# EAGLE design 1P3W_v1p0 (EAGLE 9.6.2)
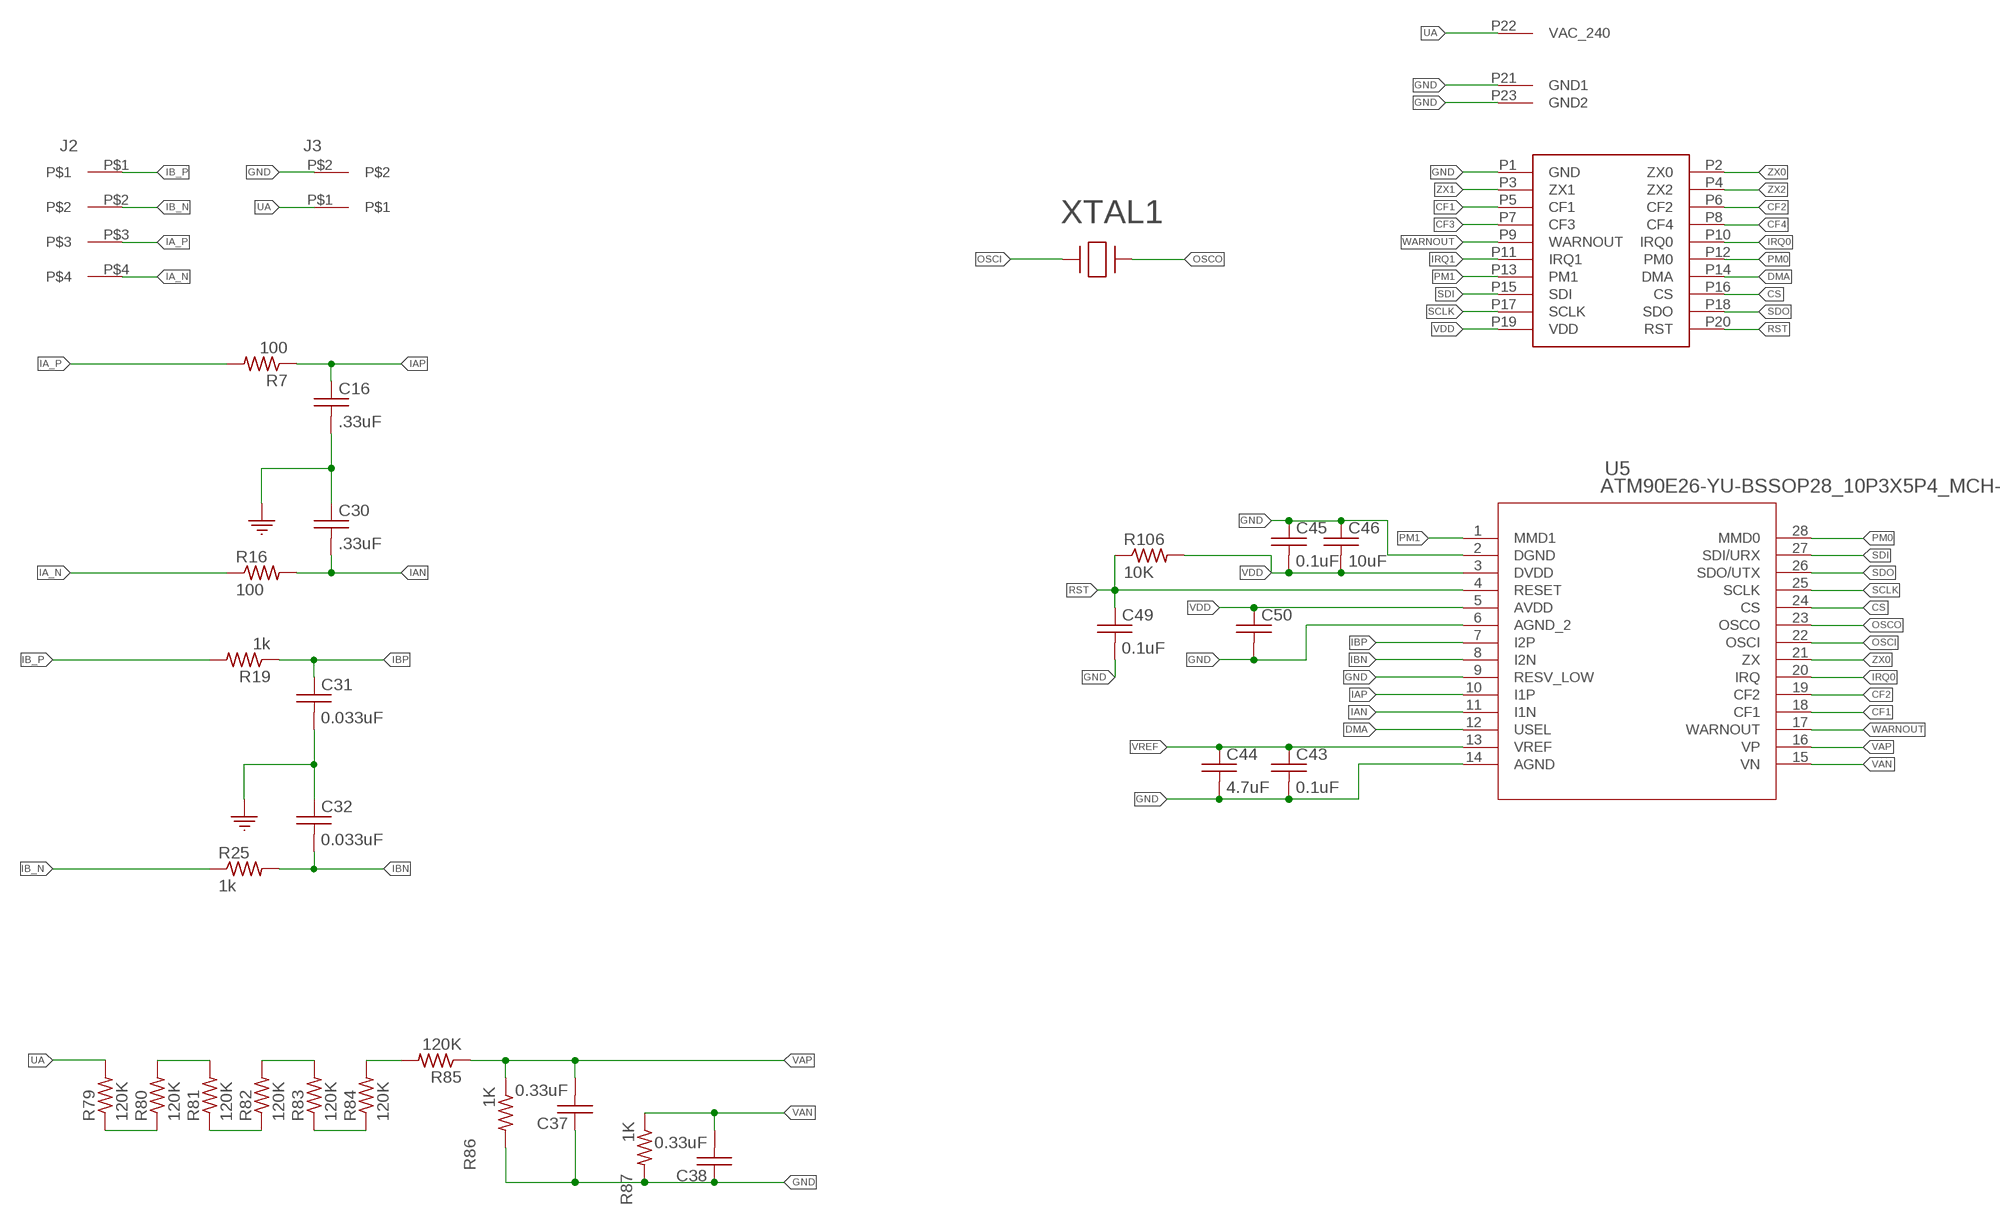
[diagram p0: schematic, sheet 1]

## Parts
C16  .33uF  C_0402  [0402]
C30  .33uF  C_0402  [0402]
C31  0.033uF  C_0402  [0402]
C32  0.033uF  C_0402  [0402]
C37  0.33uF  C_0402  [0402]
C38  0.33uF  C_0402  [0402]
C43  0.1uF  C_0402  [0402]
C44  4.7uF  C_0402  [0402]
C45  0.1uF  C_0402  [0402]
C46  10uF  C_0402  [0402]
C49  0.1uF  C_0402  [0402]
C50  C_0402  [0402]
J2  3.81MM_1_X_4_RT_ANGLE_PLUG_HEADER  [1X4_3.81MM_PITCH]
J3  3.81MM_1_X_2_RT_ANGLE_PLUG_HEADER  [2_3.81MM_PITCH]
R7  100  R_0402  [0402]
R16  100  R_0402  [0402]
R19  1k  R_0402  [0402]
R25  1k  R_0402  [0402]
R79  120K  R_0402  [0402]
R80  120K  R_0402  [0402]
R81  120K  R_0402  [0402]
R82  120K  R_0402  [0402]
R83  120K  R_0402  [0402]
R84  120K  R_0402  [0402]
R85  120K  R_0402  [0402]
R86  1K  R_0402  [0402]
R87  1K  R_0402  [0402]
R106  10K  R_0402  [0402]
U5  ATM90E26-YU-BSSOP28_10P3X5P4_MCH-M  [SSOP28_10P3X5P4_MCH-M]
U$1  METER_BASE  [METER_BASE]
XTAL1  ABLS-8.192MHZ-B2-TXTAL_HC/49US_ABLS_ABR-M  [XTAL_HC/49US_ABLS_ABR-M]

## Nets
CF1: U5.18(CF1) U$1.P5(CF1)
CF2: U5.19(CF2) U$1.P6(CF2)
CF3: U$1.P7(CF3)
CF4: U$1.P8(CF4)
CS: U5.24(CS) U$1.P16(CS)
DMA: U5.12(USEL) U$1.P14(DMA)
GND: C16.P$2 C30.P$1 C31.P$2 C32.P$1 C37.P$1 C38.P$1 C43.P$2 C44.P$2 C45.P$1 C46.P$1 C49.P$2 C50.P$2 J3.P$2 R86.P$2 R87.P$2 U5.2(DGND) U5.6(AGND_2) U5.9(RESV_LOW) U5.14(AGND) U$1.P1(GND) U$1.P21(GND1) U$1.P23(GND2)
IA_N: J2.P$4 R16.P$1
IA_P: J2.P$3 R7.P$2
IAN: C30.P$2 R16.P$2 U5.11(I1N)
IAP: C16.P$1 R7.P$1 U5.10(I1P)
IB_N: J2.P$2 R25.P$1
IB_P: J2.P$1 R19.P$2
IBN: C32.P$2 R25.P$2 U5.8(I2N)
IBP: C31.P$1 R19.P$1 U5.7(I2P)
IRQ0: U5.20(IRQ) U$1.P10(IRQ0)
IRQ1: U$1.P11(IRQ1)
N$37: R79.P$1 R80.P$1
N$38: R80.P$2 R81.P$2
N$39: R81.P$1 R82.P$1
N$40: R82.P$2 R83.P$2
N$41: R83.P$1 R84.P$1
N$42: R84.P$2 R85.P$2
OSCI: U5.22(OSCI) XTAL1.1
OSCO: U5.23(OSCO) XTAL1.2
PM0: U5.28(MMD0) U$1.P12(PM0)
PM1: U5.1(MMD1) U$1.P13(PM1)
RST: C49.P$1 R106.P$1 U5.4(RESET) U$1.P20(RST)
SCLK: U5.25(SCLK) U$1.P17(SCLK)
SDI: U5.27(SDI/URX) U$1.P15(SDI)
SDO: U5.26(SDO/UTX) U$1.P18(SDO)
UA: J3.P$1 R79.P$2 U$1.P22(VAC_240)
VAN: C38.P$2 R87.P$1 U5.15(VN)
VAP: C37.P$2 R85.P$1 R86.P$1 U5.16(VP)
VDD: C45.P$2 C46.P$2 C50.P$1 R106.P$2 U5.3(DVDD) U5.5(AVDD) U$1.P19(VDD)
VREF: C43.P$1 C44.P$1 U5.13(VREF)
WARNOUT: U5.17(WARNOUT) U$1.P9(WARNOUT)
ZX0: U5.21(ZX) U$1.P2(ZX0)
ZX1: U$1.P3(ZX1)
ZX2: U$1.P4(ZX2)

## Library data of the parts
C16 C30-C32 C37 C38 C43-C46 C49 C50 = 3D_MIG_Controller:C_0402
J2 = 3D_MIG_Controller:3.81MM_1_X_4_RT_ANGLE_PLUG_HEADER
J3 = 3D_MIG_Controller:3.81MM_1_X_2_RT_ANGLE_PLUG_HEADER
R7 R16 R19 R25 R79-R87 R106 = 3D_MIG_Controller:R_0402
U5 = 3D_MIG_Controller:ATM90E26-YU-B; BUILT_BY: EMA_Molly; COPYRIGHT: Copyright (C) 2018 Accelerated Designs. All rights reserved; MANUFACTURER_PART_NUMBER: ATM90E26-YU-B; SOURCELIBRARY: Microchip_2019-08-23_24; VENDOR: Microchip
U$1 = 3D_MIG_Controller:METER_BASE
XTAL1 = 3D_MIG_Controller:ABLS-8.192MHZ-B2-T; BUILT_BY: EMA_Cory; COPYRIGHT: Copyright (C) 2018 Accelerated Designs. All rights reserved; DATASHEET: https://abracon.com/Resonators/abls.pdf; MANUFACTURER_PART_NUMBER: ABLS-8.192MHZ-B2-T; SOURCELIBRARY: Abracon_2020-04-08; VENDOR: Abracon

## Board
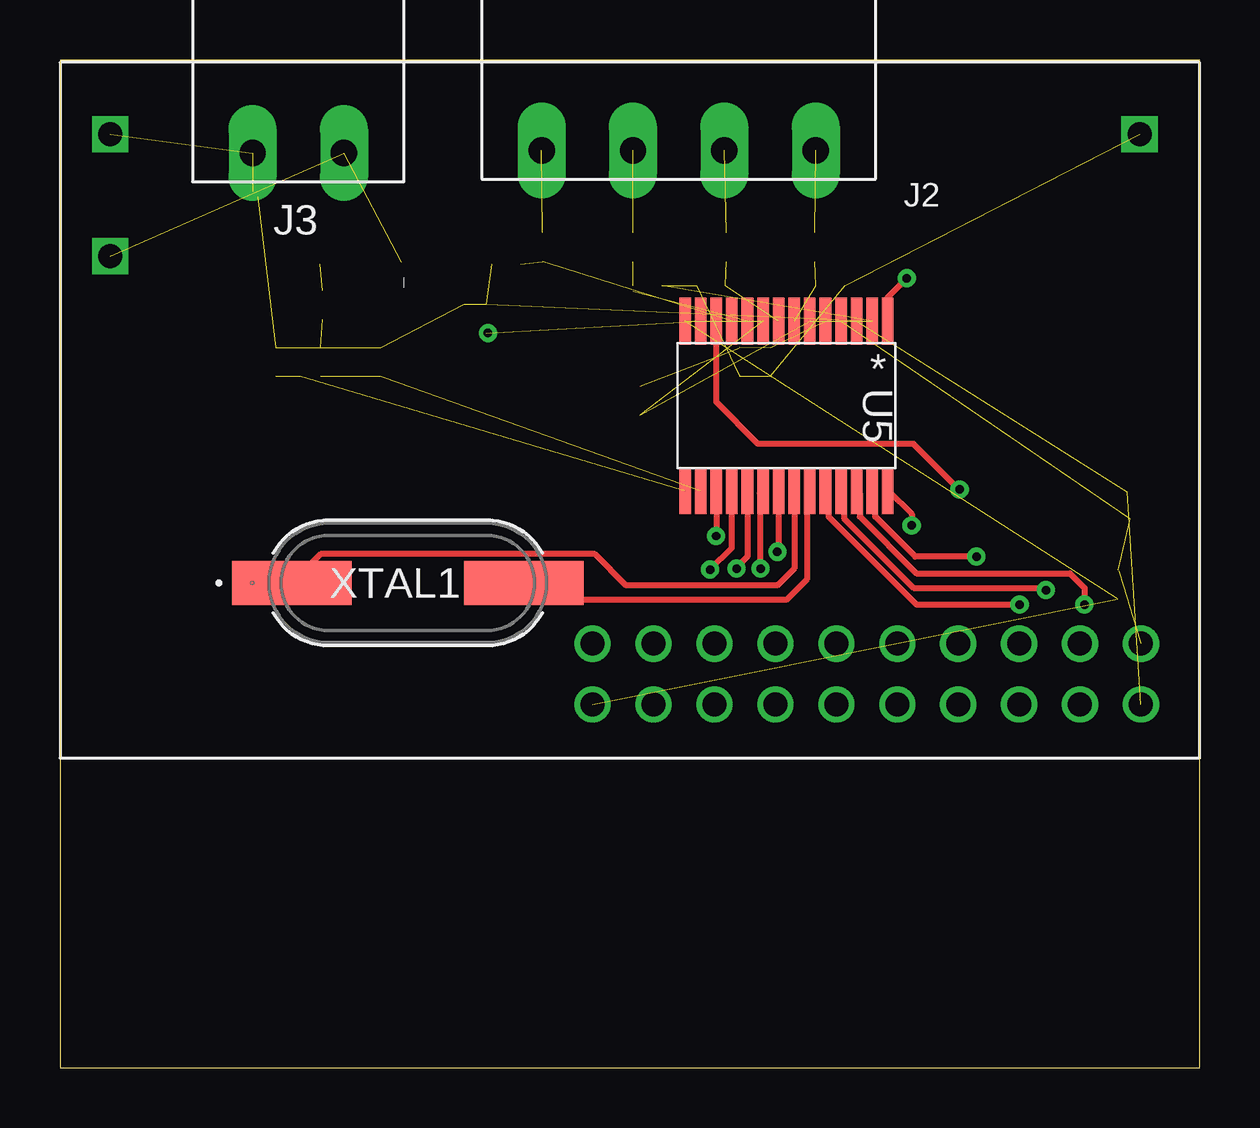
[diagram p1: board, top side]
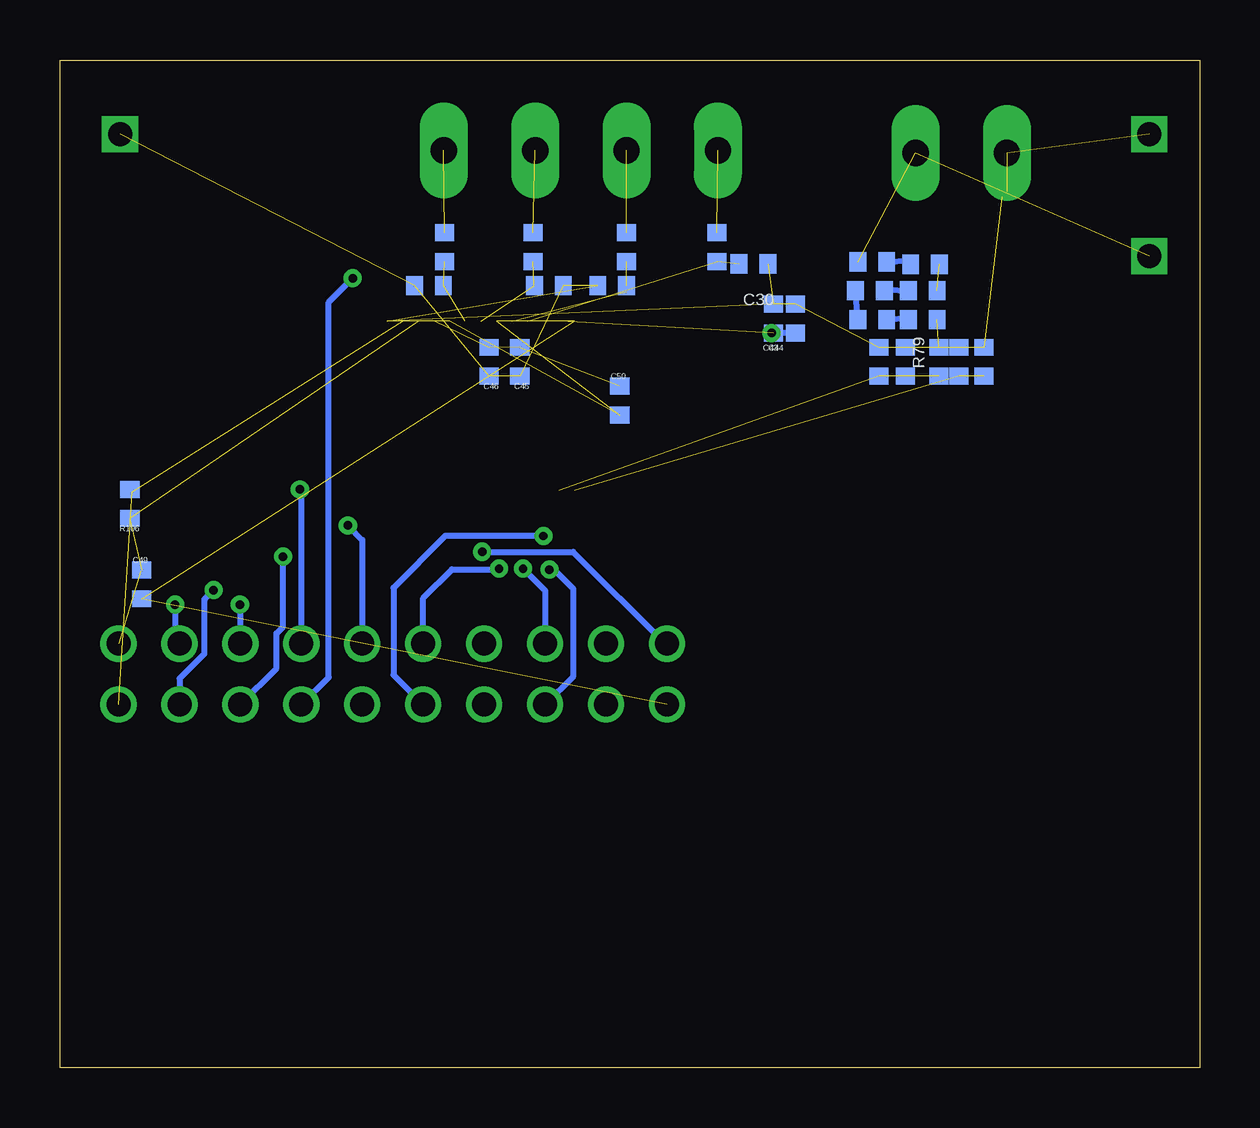
[diagram p2: board, bottom side, seen from below]

Size 47.5 x 42 mm. Coordinates in mm from the lower left corner, seen from the top.
Outline: 0,0 47.5,0 47.5,42 0,42 0,0
Copper layers (1*16): Top 0.035mm / dielectric 1.5mm / Bottom 0.035mm
Design rules "default": minimum track width 6mil, minimum drill 0.35mm, track to track 6mil, track to pad 6mil, pad to pad 6mil, via to via 6mil, smd to smd 6mil, copper to edge 40mil, drill to drill 6mil, minimum pad ring 10mil, minimum via ring 8mil, stop-mask expansion 4mil, vias tented up to drill 0mil, thermal gap 10mil

### Footprints (pad centres in the part's own frame; a part is rotated, then mirrored left to right if it is on the bottom)
0402 = smd 0.8 x 0.7: P$1 0,0.6; P$2 0,-0.6
1X4_3.81MM_PITCH = drill 1.1 pad 2 long: P$1 0,0; P$2 3.81,0; P$3 7.62,0; P$4 11.43,0
2_3.81MM_PITCH = drill 1.1 pad 2 long: P$1 0,0; P$2 3.81,0
SSOP28_10P3X5P4_MCH-M = smd 1.956 x 0.483: 1 -3.531,4.225; 2 -3.531,3.575; 3 -3.531,2.925; 4 -3.531,2.275; 5 -3.531,1.625; 6 -3.531,0.975; 7 -3.531,0.325; 8 -3.531,-0.325; 9 -3.531,-0.975; 10 -3.531,-1.625; 11 -3.531,-2.275; 12 -3.531,-2.925; 13 -3.531,-3.575; 14 -3.531,-4.225; 15 3.531,-4.225; 16 3.531,-3.575; 17 3.531,-2.925; 18 3.531,-2.275; 19 3.531,-1.625; 20 3.531,-0.975; 21 3.531,-0.325; 22 3.531,0.325; 23 3.531,0.975; 24 3.531,1.625; 25 3.531,2.275; 26 3.531,2.925; 27 3.531,3.575; 28 3.531,4.225
METER_BASE = drill 1: P1 22.2,15.23; P2 22.2,17.77; P3 24.74,15.23; P4 24.74,17.77; P5 27.28,15.23; P6 27.28,17.77; P7 29.82,15.23; P8 29.82,17.77; P9 32.36,15.23; P10 32.36,17.77; P11 34.9,15.23; P12 34.9,17.77; P13 37.44,15.23; P14 37.44,17.77; P15 39.98,15.23; P16 39.98,17.77; P17 42.52,15.23; P18 42.52,17.77; P19 45.06,15.23; P20 45.06,17.77 | drill 1 square: P21 2.1,39; P22 2.1,33.92; P23 45,39
XTAL_HC/49US_ABLS_ABR-M = smd 4.978 x 1.829: 1 -4.826,0; 2 4.826,0

### Placement (x,y rotation side)
C16  24.49,32.6 270 bottom
C30  18.59,33.5 270 bottom
C31  32.12,32.6 270 bottom
C32  27.12,32.6 270 bottom
C37  13.36,29.42 0 bottom
C38  8.99,29.42 0 bottom
C43  17.76,31.22 180 bottom
C44  16.84,31.22 180 bottom
C45  28.33,29.42 180 bottom
C46  29.61,29.42 180 bottom
C49  44.1,20.14 0 bottom
C50  24.17,27.8 0 bottom
J2  31.5,38.23 180 top
J3  11.84,38.12 180 top
R7  23.88,34.2 180 bottom
R16  20.11,34.2 0 bottom
R19  31.47,34.2 180 bottom
R25  27.78,34.2 0 bottom
R79  13.64,33.58 270 bottom
R80  11.44,33.48 90 bottom
R81  11.54,32.38 90 bottom
R82  13.74,32.38 270 bottom
R83  13.64,31.18 270 bottom
R84  11.54,31.18 90 bottom
R85  10.86,29.42 180 bottom
R86  12.26,29.42 180 bottom
R87  10.03,29.42 180 bottom
R106  44.58,23.49 180 bottom
U5  30.28,27.59 270 top
U$1  0,-0.1 0 top
XTAL1  14.5,20.2 0 top

### Tracks (layer width: path | path; a pad name or v marks a point on that pad's centre or on a via)
CF1  (via drill 0.35)
  Top 0.254: v27.1,20.76 28,21.66 U5.18
  Bottom 0.254: U$1.P5 26.1,16.31 26.1,19.96 26.9,20.76 v27.1,20.76
CF2  (via drill 0.35)
  Top 0.254: v28.2,20.8 28.2,20.84 28.66,21.3 U5.19
  Bottom 0.254: v28.2,20.8 27.28,19.88 U$1.P6
CS  (via drill 0.35)
  Top 0.254: U5.24 32.03,23.93 32.03,22.97 35.7,19.3 v40,19.3
  Bottom 0.254: v40,19.3 40,17.69 U$1.P16
DMA  (via drill 0.35)
  Top 0.254: v37.5,24.1 37.48,24.1 35.58,26 29.1,26 27.36,27.75 U5.12
  Bottom 0.254: v37.5,24.1 37.44,24.04 U$1.P14
GND  (22 unrouted)
  Top 0.254: 8.24,36.3 8.03,36.51
IA_N  (1 unrouted)
IA_P  (1 unrouted)
IAN  (2 unrouted)
  Bottom 0.254: C30.P$2
IAP  (2 unrouted)
  Bottom 0.254: 23.89,32.35 C16.P$1
IB_N  (1 unrouted)
IB_P  (1 unrouted)
IBN  (2 unrouted)
  Bottom 0.254: 27.73,32.62 C32.P$2
IBP  (2 unrouted)
IRQ0  (via drill 0.35)
  Top 0.254: U5.20 29.18,23.93 29.18,20.82 v29.2,20.8
  Bottom 0.254: U$1.P10 32.36,19.57 31.16,20.77 29.36,20.77 29.33,20.8 v29.2,20.8
N$37
  Bottom 0.254: 12.14,33.62 R79.P$1
N$38  (1 unrouted)
N$39
  Bottom 0.254: 13.04,32.42 R81.P$1
N$40
  Bottom 0.254: 14.24,31.22 R82.P$2
N$41
  Bottom 0.254: 12.14,31.22 R83.P$1
N$42  (1 unrouted)
OSCI
  Top 0.254: XTAL1.1 10.87,21.4 22.3,21.4 23.6,20.1 29.9,20.1 30.61,20.8 U5.22
OSCO
  Top 0.254: U5.23 31.13,23.93 31.13,20.35 30.27,19.5 20.03,19.5 XTAL1.2
PM0  (via drill 0.35)
  Top 0.254: U5.28 35.5,23.06 v35.5,22.6
  Bottom 0.254: v35.5,22.6 34.9,22 U$1.P12
PM1  (via drill 0.35)
  Top 0.254: v35.3,32.9 34.51,32.1 U5.1
  Bottom 0.254: U$1.P13 36.3,16.27 36.3,31.9 v35.3,32.9
RST  (3 unrouted)
  Bottom 0.254: 44.14,20.7 C49.P$1 | 44.6,22.88 R106.P$1
SCLK  (via drill 0.35)
  Top 0.254: U5.25 32.68,23.93 32.68,22.89 35.58,20 41,20 v41.1,19.9
  Bottom 0.254: v41.1,19.9 41.49,19.51 41.49,17.24 42.52,16.21 U$1.P17
SDI  (via drill 0.35)
  Top 0.254: U5.27 33.98,23.93 33.98,22.97 35.65,21.3 v38.2,21.3
  Bottom 0.254: v38.2,21.3 38.2,18.37 38.47,18.1 38.47,16.64 U$1.P15
SDO  (via drill 0.35)
  Top 0.254: U5.26 33.33,23.93 33.33,22.97 35.7,20.6 42.1,20.6 42.7,20 v42.7,19.3
  Bottom 0.254: v42.7,19.3 42.7,17.85 U$1.P18
UA  (2 unrouted)
VAN  (2 unrouted)
VAP  (3 unrouted)
  Bottom 0.254: R86.P$1 12.24,28.82
VDD  (6 unrouted)
  Bottom 0.254: R106.P$2 44.49,24 | 28.31,30 C45.P$2
VREF  (via drill 0.35)  (1 unrouted)
  Top 0.254: 18.08,30.62 v17.84,30.62
  Bottom 0.254: C43.P$1 v17.84,30.62 C44.P$1
WARNOUT  (via drill 0.35)
  Top 0.254: U5.17 v27.36,22.16 v27.35,22.16
  Bottom 0.254: v27.35,22.16 31.44,22.16 33.6,20 33.6,16.37 U$1.P9
ZX0  (via drill 0.35)
  Top 0.254: U5.21 29.95,21.55 v29.9,21.5
  Bottom 0.254: v29.9,21.5 26.11,21.5 22.28,17.67 U$1.P2